# EAGLE schematic protection and ch (EAGLE 7.4.0)
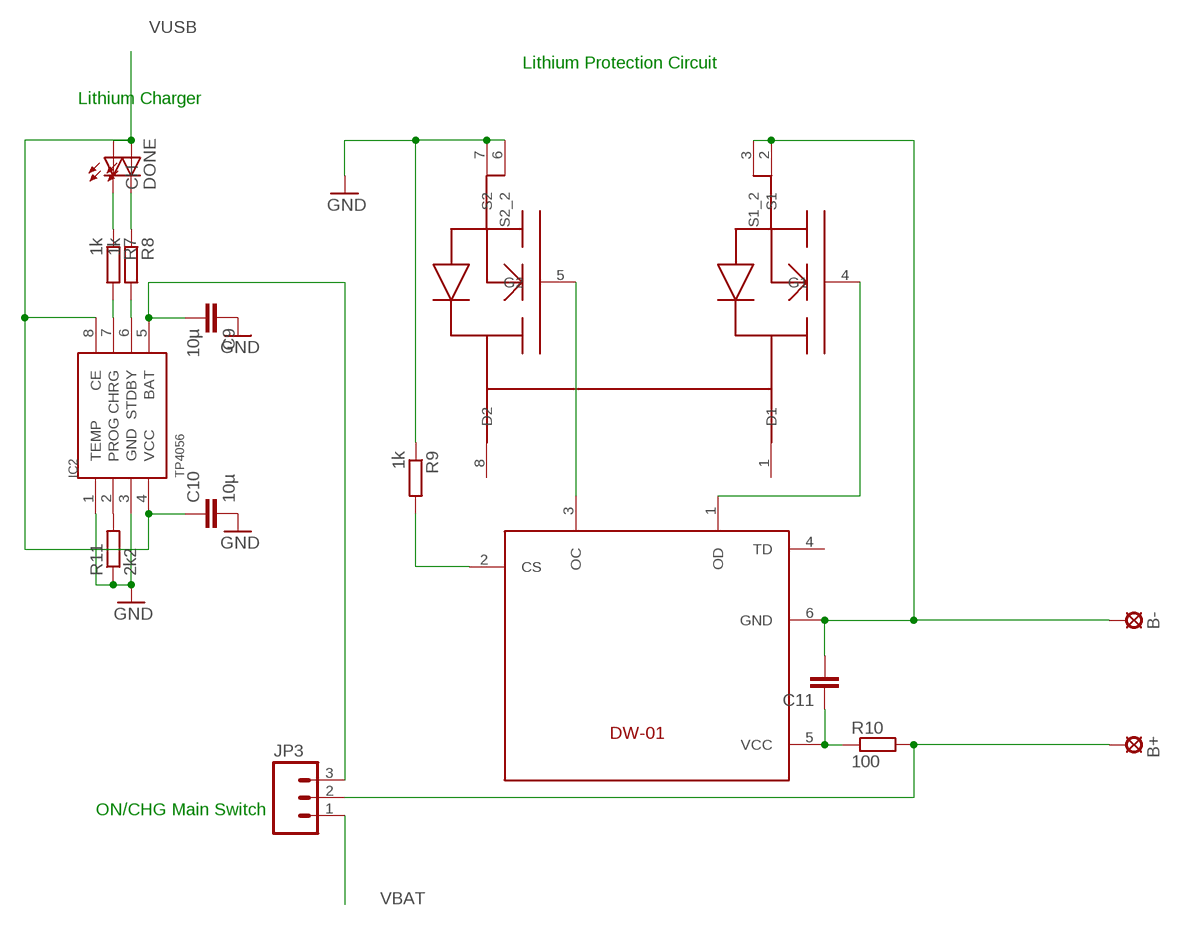
[diagram p0: schematic, sheet 1]

## Parts
B+  LSP10  [LSP10]
B-  LSP10  [LSP10]
C9  10µ  C-EUC0805K  [C0805K]
C10  10µ  C-EUC0805K  [C0805K]
C11  C-EUC0603  [C0603]
CH  LEDCHIP-LED0805  [CHIP-LED0805]
DONE  LEDCHIP-LED0805  [CHIP-LED0805]
IC2  TP4056  [SOP-8]
JP3  M03PTH  [1X03]
R7  1k  R-EU_R0603  [R0603]
R8  1k  R-EU_R0603  [R0603]
R9  1k  R-EU_R0603  [R0603]
R10  100  R-EU_R0603  [R0603]
R11  2k2  R-EU_R0603  [R0603]
U$1  DW-01  [SOT23-6]
U$4  8205A  [TSSOP8]

## Nets
GND: C9.1 C10.2 IC2.1(TEMP) IC2.3(GND) R9.1 R11.1 U$4.6(S2_2) U$4.7(S2)
N$31: U$1.1(OD) U$4.4(G1)
N$32: U$1.3(OC) U$4.5(G2)
N$33: C11.1 R10.1 U$1.5(VCC)
N$34: IC2.7(CHRG) R7.2
N$35: B-.MP C11.2 U$1.6(GND) U$4.2(S1) U$4.3(S1_2)
N$36: R9.2 U$1.2(CS)
N$38: IC2.6(STDBY) R8.2
N$39: CH.C R7.1
N$40: DONE.C R8.1
N$42: C9.2 IC2.5(BAT) JP3.3
N$43: IC2.2(PROG) R11.2
VBAT: B+.MP JP3.1 JP3.2 R10.2
VUSB: C10.1 CH.A DONE.A IC2.4(VCC) IC2.8(CE)
Unconnected: U$1.4(TD) U$4.1(D1) U$4.8(D2)

## Notes on the sheet
- Lithium Protection Circuit
- Lithium Charger
- ON/CHG Main Switch

## Library data of the parts
B+ B- = solpad:LSP10: SOLDER PAD drill 1.0 mm, distributor Buerklin, 12H555
C9-C11 = rcl:C-EU: CAPACITOR, European symbol
CH DONE = adafruit:LED: LED OSRAM: - CHIPLED LG R971, LG N971, LY N971, LG Q971, LY Q971, LO R971, LY R971 LH N974, LH R974 LS Q976, LO Q976, LY Q976 LO Q996 - Hyper CHIPLED LW Q18S LB Q993, LB Q99A, LB R99A - SideLED LS A670, LO A670, LY A670, LG A670, LP A670 LB A673, LV A673, LT A673, LW A673 LH A674 LY A675 LS A676, LA A676, LO A676, LY A676, LW A676 LS A679, LY A679, LG A679 - Hyper Micro SIDELED® LS Y876, LA Y876, LO Y876, LY Y876 LT Y87S - SmartLED LW L88C, LW L88S LB L89C, LB L89S, LG L890 LS L89K, LO L89K, LY L89K LS L896, LA L896, LO L896, LY L896 - TOPLED LS T670, LO T670, LY T670, LG T670, LP T670 LSG T670, LSP T670, LSY T670, LOP T670, LYG T670 LG T671, LOG T671, LSG T671 LB T673, LV T673, LT T673, LW T673 LH T674 LS T676, LA T676, LO T676, LY T676, LB T676, LH T676, LSB T676, LW T676 LB T67C, LV T67C, LT T67C, LS T67K, LO T67K, LY T67K, LW E67C LS E67B, LA E67B, LO E67B, LY E67B, LB E67C, LV E67C, LT E67C LW T67C LS T679, LY T679, LG T679 LS T770, LO T770, LY T770, LG T770, LP T770 LB T773, LV T773, LT T773, LW T773 LH T774 LS E675, LA E675, LY E675, LS T675 LS T776, LA T776, LO T776, LY T776, LB T776 LHGB T686 LT T68C, LB T68C - Hyper Mini TOPLED® LB M676 - Mini TOPLED Santana® LG M470 LS M47K, LO M47K, LY M47K Source: http://www.osram.convergy.de/
IC2 = TP4056:TP4056
JP3 = SparkFun-Connectors:M03: Header 3 Standard 3-pin 0.1" header. Use with straight break away headers (SKU : PRT-00116), right angle break away headers (PRT-00553), swiss pins (PRT-00743), machine pins (PRT-00117), and female headers (PRT-00115). Molex polarized connector foot print use with SKU : PRT-08232 with associated crimp pins and housings.
R7-R11 = rcl:R-EU_: RESISTOR, European symbol
U$1 = DW-01:DW-01
U$4 = 8205A:8205A